# EAGLE design esp32_with_oled_128x64_v2 (EAGLE 9.5.2)
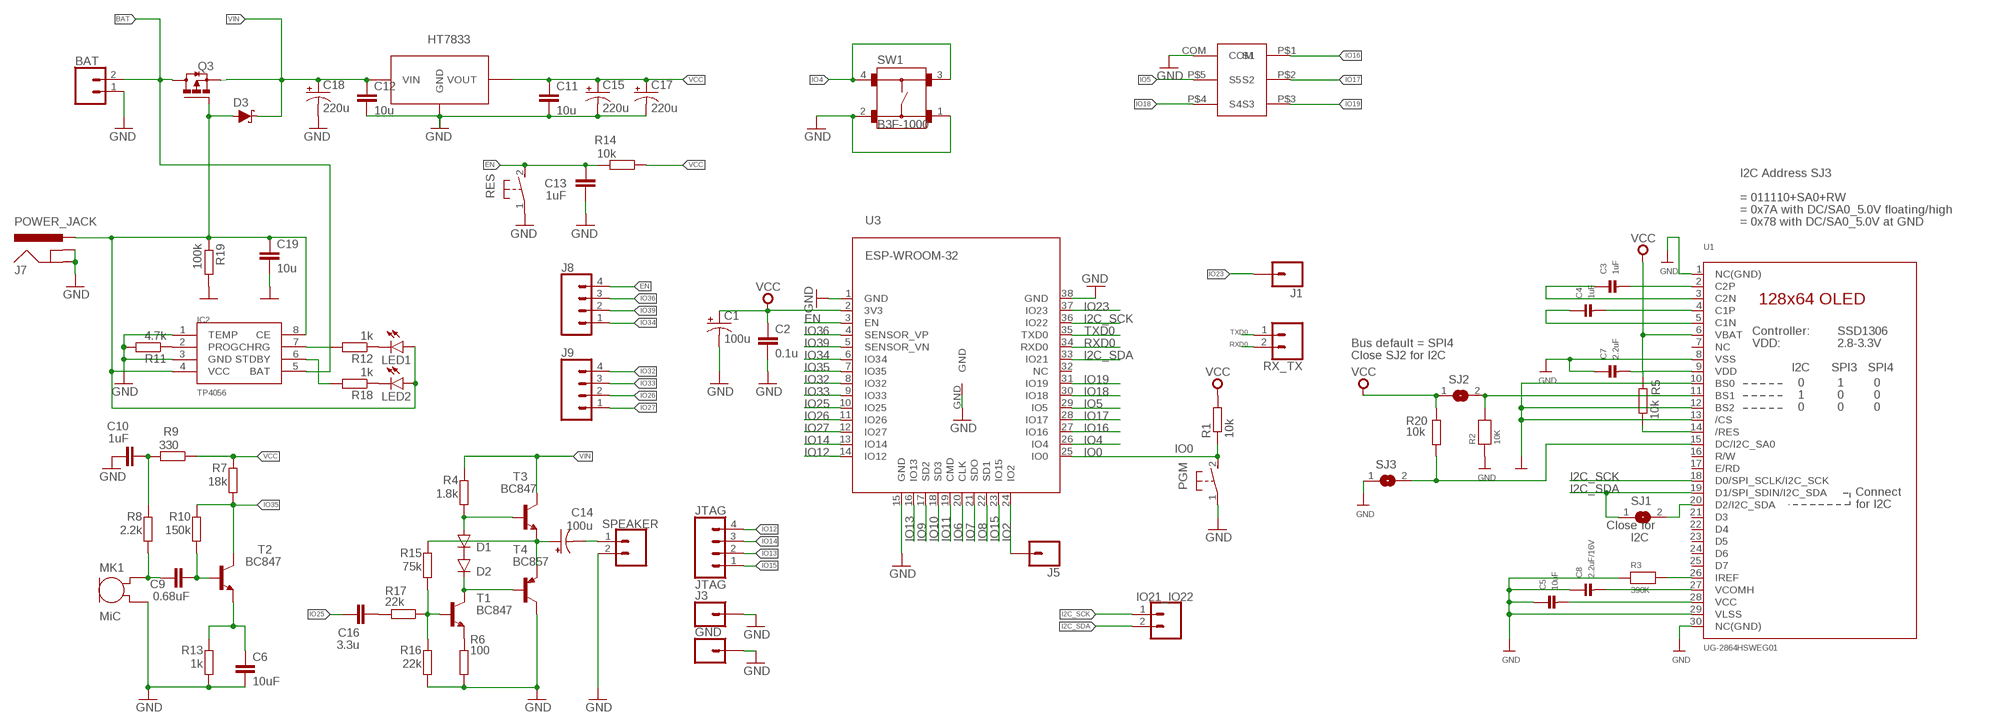
[diagram p0: schematic, sheet 1]

## Parts
BAT  CONN_02  [1X02]
C1  100u  CAP_POLSMD  [VISHAY_C]
C2  0.1u  CAP0805  [0805]
C3  1uF  CAP_CERAMIC0805  [0805]
C4  1uF  CAP_CERAMIC0805  [0805]
C5  10uF  CAP_CERAMIC0805  [0805]
C6  10uF  CAP0805  [0805]
C7  2.2uF  CAP_CERAMIC0805  [0805]
C8  2.2uF/16V  CAP_CERAMIC0805  [0805]
C9  0.68uF  CAP0805  [0805]
C10  1uF  CAP0805  [0805]
C11  10u  C-EUC0805K  [C0805K]
C12  10u  C-EUC0805K  [C0805K]
C13  1uF  CAP0805  [0805]
C14  100u  CAP_POLPTH1  [CPOL-RADIAL-100UF-25V]
C15  220u  CAP_POLPTH1  [CPOL-RADIAL-100UF-25V]
C16  3.3u  CAP0805  [0805]
C17  220u  CAP_POLPTH1  [CPOL-RADIAL-100UF-25V]
C18  220u  CAP_POLPTH1  [CPOL-RADIAL-100UF-25V]
C19  10u  C-EUC0805K  [C0805K]
D1  DIODE-SOD323-W  [SOD323-W]
D2  DIODE-SOD323-W  [SOD323-W]
D3  DIODE-SCHOTTKY-BAT20J  [SOD-323]
GND  CONN_01  [1X01]
IC2  TP4056  [SOP-8]
IO21_IO22  CONN_02  [1X02]
J1  CONN_01  [1X01]
J3  CONN_01  [1X01]
J5  CONN_01  [1X01]
J7  POWER_JACK  [POWER_JACK_PTH]
J8  CONN_04  [1X04]
J9  CONN_04  [1X04]
JTAG  JTAG  CONN_04  [1X04]
LED1  LED3MM  [LED3MM]
LED2  LEDCHIP-LED0805  [CHIP-LED0805]
MK1  MiC  CMA-4544PF-W  [CMA-4544PF-W]
PGM  DTSM-3  [DTSM-3]
Q3  FDN360P  [SUPER-SOT3]
R1  10k  R-EU_R0805  [R0805]
R2  10K  RESISTOR0805_NOTHERMALS  [0805_NOTHERMALS]
R3  390K  RESISTOR0805_NOTHERMALS  [0805_NOTHERMALS]
R4  1.8k  R-EU_R0805  [R0805]
R5  10k  R-EU_R0805  [R0805]
R6  100  R-EU_R0805  [R0805]
R7  18k  R-EU_R0805  [R0805]
R8  2.2k  R-EU_R0805  [R0805]
R9  330  R-EU_R0805  [R0805]
R10  150k  R-EU_R0805  [R0805]
R11  4.7k  R-EU_R0805  [R0805]
R12  1k  R-EU_R0805  [R0805]
R13  1k  R-EU_R0805  [R0805]
R14  10k  R-EU_R0805  [R0805]
R15  75k  R-EU_R0805  [R0805]
R16  22k  R-EU_R0805  [R0805]
R17  22k  R-EU_R0805  [R0805]
R18  1k  R-EU_R0805  [R0805]
R19  100k  R-EU_R0805  [R0805]
R20  10k  R-EU_R0805  [R0805]
RES  DTSM-3  [DTSM-3]
RX_TX  CONN_02  [1X02]
SJ1  SOLDERJUMPERREFLOW_NOPASTE  [SOLDERJUMPER_REFLOW_NOPASTE]
SJ2  SOLDERJUMPERREFLOW_NOPASTE  [SOLDERJUMPER_REFLOW_NOPASTE]
SJ3  SOLDERJUMPERREFLOW_NOPASTE  [SOLDERJUMPER_REFLOW_NOPASTE]
SPEAKER  CONN_02  [1X02]
SW1  B3F-1000  [B3F-1000]
T1  BC847  [SOT23]
T2  BC847  [SOT23]
T3  BC847  [SOT23]
T4  BC857  BC857ASMD  [SOT23-BEC]
U1  UG-2864HSWEG01  DISP_OLED_UG-2864HSWEG010.96"  [UG-2864HSWEG01_0.96IN_WRAPAROUND]
U3  ESP-WROOM-32  [ESP-WROOM-32]
U$1  DJOYSTICK-MY  [DJOYSTIC-MY]
U$3  HT7833  HT7333  [SOT89]

## Nets
BAT: BAT.2 IC2.5(BAT) Q3.3(D)
EN: C13.2 J8.4 R14.2 RES.2 U3.3(EN)
GND: BAT.1 C1.- C2.2 C5.1 C6.2 C7.1 C8.1 C10.1 C11.2 C12.2 C13.1 C15.2(-) C17.2(-) C18.2(-) C19.2 GND.1 IC2.1(TEMP) IC2.3(GND) J3.1 J7.GND J7.GNDBREAK MK1.2(GND) PGM.1 R2.1 R3.1 R6.1 R11.2 R13.1 R16.1 R19.2 RES.1 SJ3.1 SPEAKER.2 SW1.1 SW1.2 T4.C U1.1(NC(GND)) U1.8(VSS) U1.10(BS0) U1.12(BS2) U1.13(/CS) U1.29(VLSS) U1.30(NC(GND)) U3.1(GND) U3.15(GND) U3.38(GND) U3.GND U$1.COM U$3.GND
I2C_SCK: IO21_IO22.1 U1.18(D0/SPI_SCLK/I2C_SCK) U3.36(IO22)
I2C_SDA: IO21_IO22.2 SJ1.1 U1.19(D1/SPI_SDIN/I2C_SDA) U3.33(IO21)
IO0: PGM.2 R1.1 U3.25(IO0)
IO2: J5.1 U3.24(IO2)
IO4: SW1.3 SW1.4 U3.26(IO4)
IO5: U3.29(IO5) U$1.P$5(S5)
IO6: U3.20(CLK)
IO7: U3.21(SDO)
IO8: U3.22(SD1)
IO9: U3.17(SD2)
IO10: U3.18(SD3)
IO11: U3.19(CMD)
IO12: JTAG.4 U3.14(IO12)
IO13: JTAG.2 U3.16(IO13)
IO14: JTAG.3 U3.13(IO14)
IO15: JTAG.1 U3.23(IO15)
IO16: U3.27(IO16) U$1.P$1(S1)
IO17: U3.28(IO17) U$1.P$2(S2)
IO18: U3.30(IO18) U$1.P$4(S4)
IO19: U3.31(IO19) U$1.P$3(S3)
IO23: J1.1 U3.37(IO23)
IO25: C16.1 U3.10(IO25)
IO26: J9.2 U3.11(IO26)
IO27: J9.1 U3.12(IO27)
IO32: J9.4 U3.8(IO32)
IO33: J9.3 U3.9(IO33)
IO34: J8.1 U3.6(IO34)
IO35: R7.1 R10.2 T2.3(C) U3.7(IO35)
IO36: J8.3 U3.4(SENSOR_VP)
IO39: J8.2 U3.5(SENSOR_VN)
N$1: R2.2 SJ2.2 U1.11(BS1)
N$2: SJ1.2 U1.20(D2/I2C_SDA)
N$3: R3.2 U1.26(IREF)
N$4: C3.2 U1.2(C2P)
N$5: C3.1 U1.3(C2N)
N$6: C4.2 U1.4(C1P)
N$7: C4.1 U1.5(C1N)
N$8: C19.1 D3.A IC2.4(VCC) IC2.8(CE) J7.PWR LED1.A LED2.A Q3.1(G) R19.1
N$9: C14.2(-) SPEAKER.1
N$10: C16.2 R17.2
N$11: C5.2 U1.28(VCC)
N$12: C8.2 U1.27(VCOMH)
N$13: D1.A R4.1 T3.1(B)
N$14: C6.1 R13.2 T2.2(E)
N$15: C9.2 R10.1 T2.1(B)
N$16: C10.2 R8.2 R9.2
N$17: C9.1 MK1.1(OUT) R8.1
N$18: D2.C T1.3(C) T4.B
N$19: IC2.2(PROG) R11.1
N$20: R15.1 R16.2 R17.1 T1.1(B)
N$21: LED1.K(C) R12.1
N$22: IC2.7(CHRG) R12.2
N$24: D1.C D2.A
N$25: R6.2 T1.2(E)
N$26: C14.1(+) R15.2 T3.2(E) T4.E
N$27: LED2.C R18.1
N$28: IC2.6(STDBY) R18.2
N$29: R20.2 SJ3.2 U1.15(DC/I2C_SA0)
N$30: R5.1 U1.14(/RES)
RXD0: RX_TX.2 U3.34(RXD0)
TXD0: RX_TX.1 U3.35(TXD0)
VCC [vcc]: C1.+ C2.1 C7.2 C11.1 C15.1(+) C17.1(+) R1.2 R5.2 R7.2 R9.1 R14.1 R20.1 SJ2.1 U1.6(VBAT) U1.9(VDD) U3.2(3V3) U$3.VOUT
VIN: C12.1 C18.1(+) D3.C Q3.2(S) R4.2 T3.3(C) U$3.VIN
Unconnected: U1.7(NC) U1.16(R/W) U1.17(E/RD) U1.21(D3) U1.22(D4) U1.23(D5) U1.24(D6) U1.25(D7) U3.32(NC)

## Notes on the sheet
- I2C Address SJ3
- = 011110+SA0+RW
- = 0x7A with DC/SA0_5.0V floating/high
- = 0x78 with DC/SA0_5.0V at GND
- Bus default = SPI4
- Close SJ2 for I2C
- Close for
- I2C

## Library data of the parts
BAT IO21_IO22 RX_TX SPEAKER = SparkFun-Connectors:CONN_02: Multi connection point. Often used as Generic Header-pin footprint for 0.1 inch spaced/style header connections On any of the 0.1 inch spaced packages, you can populate with these: Break Away Headers - Straight <https://www.sparkfun.com/products/116> (PRT-00116) Break Away Male Headers - Right Angle <https://www.sparkfun.com/products/553> (PRT-00553) Female Headers <https://www.sparkfun.com/products/115> (PRT-00115) Break Away Headers - Machine Pin <https://www.sparkfun.com/products/117> (PRT-00117) Break Away Female Headers - Swiss Machine Pin <https://www.sparkfun.com/products/743> (PRT-00743) For SCREWTERMINALS and SPRING TERMINALS visit here: Screw Terimnals on SparkFun.com <https://www.sparkfun.com/search/results?term=Screw+Terminals> (5mm/3.5mm/2.54mm spacing) This device is also useful as a general connection point to wire up your design to another part of your project. Our various solder wires solder well into these plated through hole pads. Hook-Up Wire - Assortment (Stranded, 22 AWG) <https://www.sparkfun.com/products/11375> (PRT-11375) Hook-Up Wire - Assortment (Solid Core, 22 AWG) <https://www.sparkfun.com/products/11367> (PRT-11367) View the entire wire category on our website here <https://www.sparkfun.com/categories/141> Special notes: Molex polarized connector foot print use with: PRT-08233 with associated crimp pins and housings. 2.54_SCREWTERM for use with PRT-10571. 3.5mm Screw Terminal footprints for PRT-08084 5mm Screw Terminal footprints for use with PRT-08432
C1 C14 C15 C17 C18 = SparkFun-Passives:CAP_POL: Capacitor Polarized These are standard SMD and PTH capacitors. Normally 10uF, 47uF, and 100uF in electrolytic and tantalum varieties. Always verify the external diameter of the through hole cap, it varies with capacity, voltage, and manufacturer. The EIA devices should be standard.
C2 C6 C9 C10 C13 C16 = SparkFun-Passives:CAP: Capacitor Standard 0603 ceramic capacitor, and 0.1" leaded capacitor.
C3-C5 C7 C8 = microbuilder:CAP_CERAMIC: Ceramic Capacitors 0402 - 0402 Surface Mount Capacitors 16pF 50V 5% [Digikey: 445-4899-2-ND] 18pF 50V 5% [Digikey: 490-1281-2-ND] 22pF 50V 5% [Digikey: 490-1283-2-ND] 68pF 50V 5% [Digikey: 490-1289-2-ND] 0.1uF 10V 10% [Digikey: 490-1318-2-ND] 1.0uF 6.3V 10% [Digikey: 490-1320-2-ND] 0603 - 0603 Surface Mount Capacitors 16 pF 50V 5% [Digikey: 445-5051-2-ND] 22 pF 50V [Digikey: PCC220ACVTR-ND] 33 pF 50V 5% [Digikey: 490-1415-1-ND] 56pF 50V 5% [Digikey: 490-1421-1-ND] 220pF 50V 5% [Digikey: 445-1285-1-ND] 680 pF 50V 2200 pF 50V 5% C0G [Digikey: 445-1297-1-ND] 5600 pF 100V 5% X7R [Digikey: 478-3711-1-ND] 0.1 µF 25V 10% [Digikey: PCC2277TR-ND] 0.22 µF 16V 10% X7R [Digikey: 445-1318-1-ND] 1.0 µF 25V 10% [Digikey: 445-5146-2-ND] 0603 - RF Specific 3pF 250V +/-0.1pF RF [Digikey: 712-1347-1-ND] 18 pF 250V 5% [Digikey: 478-3505-1-ND or 712-1322-1-ND] 56 pF 250V 5% C0G RF [Digikey: 490-4867-1-ND] 68 pF 250V RF [Digikey: 490-4868-1-ND] 0805 - 0805 Surface Mount Capacitors 220 pF 250V 2% RF Ceramic Capacitor [Digikey: 712-1398-1-ND] 1000 pF 50V 2% NP0 Ceramic Capacitor [Digikey: 478-3760-1-ND] 0.1 µF 25V 10% Ceramic Capacitor [Digikey: PCC1828TR-ND] 1.0 µF 16V 10% Ceramic Capacitor[Digikey: 490-1691-2-ND] 10.0 µF 10V 10% Ceramic Capacitor[Digikey: 709-1228-1-ND] 10.0 uF 16V 10% Ceramic Capacitor [Digikey: 478-5165-2-ND] 47 uF 6.3V 20% Ceramic Capacitor [Digikey: 587-1779-1-ND or 399-5506-1-ND] 1206 - 1206 Surface Mount Capacitors 47uF 10V 20% Ceramic Capacitor [Digikey: 490-5528-1-ND or 399-5508-1-ND or 445-6010-1-ND] 100uF 6.3V -20%, +80% Y5V Ceramic Capacitor (Digikey: 490-4512-1-ND, Mouser: 81-GRM31CF50J107ZE1L)
C11 C12 C19 = rcl:C-EU: CAPACITOR, European symbol; SPICEPREFIX: C
D1 D2 = diode:DIODE-: DIODE
D3 = SparkFun-DiscreteSemi:DIODE-SCHOTTKY: Schottky diode A Schottky diode is a semiconductor diode which has a low forward voltage drop and a very fast switching action.; PROD_ID: DIO-11623; VALUE: 1A/23V/620mV
GND J1 J3 J5 = SparkFun-Connectors:CONN_01: Single connection point. Often used as Generic Header-pin footprint for 0.1 inch spaced/style header connections On any of the 0.1 inch spaced packages, you can populate with these: Break Away Headers - Straight <https://www.sparkfun.com/products/116> (PRT-00116) Break Away Male Headers - Right Angle <https://www.sparkfun.com/products/553> (PRT-00553) Female Headers <https://www.sparkfun.com/products/115> (PRT-00115) Break Away Headers - Machine Pin <https://www.sparkfun.com/products/117> (PRT-00117) Break Away Female Headers - Swiss Machine Pin <https://www.sparkfun.com/products/743> (PRT-00743) This device is also useful as a general connection point to wire up your design to another part of your project. Our various solder wires solder well into these plated through hole pads. Hook-Up Wire - Assortment (Stranded, 22 AWG) <https://www.sparkfun.com/products/11375> (PRT-11375) Hook-Up Wire - Assortment (Solid Core, 22 AWG) <https://www.sparkfun.com/products/11367> (PRT-11367) View the entire wire category on our website here <https://www.sparkfun.com/categories/141> Special notes: SMTSO-256-ET is a "flush mount" nut for a 4-40 screw. We mostly use this on specialty testbeds; it is a nice way to connect hardware to your PCB at an adjustable hieght. Also note, the SNAP packages are for using a snappable style connector. We sell a baggie of snaps and they are also used on two LilyPad designs: Snap Assortment - 30 pack (male and female) <https://www.sparkfun.com/products/11347> (DEV-11347) LilyPad Arduino SimpleSnap <https://www.sparkfun.com/products/10941> (DEV-10941) LilyPad SimpleSnap Protoboard <https://www.sparkfun.com/products/10940> (DEV-10940)
IC2 = TP4056:TP4056
J7 = SparkFun-Connectors:POWER_JACK: Power Jack Connector This is the standard 5.5mm barrel jack for power. The PTH is the most common, proven, reliable, footprint. The Slot footprint only works if the mill layer is transmitted to the PCB fab house so be warned. Here are the connectors we sell at SparkFun: DC Barrel Power Jack/Connector <https://www.sparkfun.com/products/119> (PRT-00119) DC Barrel Power Jack/Connector (SMD) <https://www.sparkfun.com/products/12748> (PRT-12748) DC Barrel Jack Adapter - Breadboard Compatible <https://www.sparkfun.com/products/10811> (PRT-10811) It is used on this SparkFun product (and many, many others): SparkFun RedBoard - Programmed with Arduino <https://www.sparkfun.com/products/12757> (DEV-12757) Also, if you need a mating power supply or connector, please check these out: Wall Adapter Power Supply - 9VDC 650mA <https://www.sparkfun.com/products/298> (TOL-00298) DC Barrel Jack Adapter - Male <https://www.sparkfun.com/products/10287> (PRT-10287); PROD_ID: CONN-08197
J8 J9 JTAG = SparkFun-Connectors:CONN_04: Multi connection point. Often used as Generic Header-pin footprint for 0.1 inch spaced/style header connections On any of the 0.1 inch spaced packages, you can populate with these: Break Away Headers - Straight <https://www.sparkfun.com/products/116> (PRT-00116) Break Away Male Headers - Right Angle <https://www.sparkfun.com/products/553> (PRT-00553) Female Headers <https://www.sparkfun.com/products/115> (PRT-00115) Break Away Headers - Machine Pin <https://www.sparkfun.com/products/117> (PRT-00117) Break Away Female Headers - Swiss Machine Pin <https://www.sparkfun.com/products/743> (PRT-00743) For SCREWTERMINALS and SPRING TERMINALS visit here: Screw Terimnals on SparkFun.com <https://www.sparkfun.com/search/results?term=Screw+Terminals> (5mm/3.5mm/2.54mm spacing) This device is also useful as a general connection point to wire up your design to another part of your project. Our various solder wires solder well into these plated through hole pads. Hook-Up Wire - Assortment (Stranded, 22 AWG) <https://www.sparkfun.com/products/11375> (PRT-11375) Hook-Up Wire - Assortment (Solid Core, 22 AWG) <https://www.sparkfun.com/products/11367> (PRT-11367) View the entire wire category on our website here <https://www.sparkfun.com/categories/141> Special notes: Molex polarized connector foot print use with SKU : PRT-08231 with associated crimp pins and housings. 1MM SMD Version SKU: PRT-10208; PROD_ID: CONN-09696
LED1 LED2 = led:LED: LED OSRAM: - CHIPLED LG R971, LG N971, LY N971, LG Q971, LY Q971, LO R971, LY R971 LH N974, LH R974 LS Q976, LO Q976, LY Q976 LO Q996 - Hyper CHIPLED LW Q18S LB Q993, LB Q99A, LB R99A - SideLED LS A670, LO A670, LY A670, LG A670, LP A670 LB A673, LV A673, LT A673, LW A673 LH A674 LY A675 LS A676, LA A676, LO A676, LY A676, LW A676 LS A679, LY A679, LG A679 - Hyper Micro SIDELED® LS Y876, LA Y876, LO Y876, LY Y876 LT Y87S - SmartLED LW L88C, LW L88S LB L89C, LB L89S, LG L890 LS L89K, LO L89K, LY L89K LS L896, LA L896, LO L896, LY L896 - TOPLED LS T670, LO T670, LY T670, LG T670, LP T670 LSG T670, LSP T670, LSY T670, LOP T670, LYG T670 LG T671, LOG T671, LSG T671 LB T673, LV T673, LT T673, LW T673 LH T674 LS T676, LA T676, LO T676, LY T676, LB T676, LH T676, LSB T676, LW T676 LB T67C, LV T67C, LT T67C, LS T67K, LO T67K, LY T67K, LW E67C LS E67B, LA E67B, LO E67B, LY E67B, LB E67C, LV E67C, LT E67C LW T67C LS T679, LY T679, LG T679 LS T770, LO T770, LY T770, LG T770, LP T770 LB T773, LV T773, LT T773, LW T773 LH T774 LS E675, LA E675, LY E675, LS T675 LS T776, LA T776, LO T776, LY T776, LB T776 LHGB T686 LT T68C, LB T68C - Hyper Mini TOPLED® LB M676 - Mini TOPLED Santana® LG M470 LS M47K, LO M47K, LY M47K Source: http://www.osram.convergy.de LUXEON: - LUMILED® LXK2-PW12-R00, LXK2-PW12-S00, LXK2-PW14-U00, LXK2-PW14-V00 LXK2-PM12-R00, LXK2-PM12-S00, LXK2-PM14-U00 LXK2-PE12-Q00, LXK2-PE12-R00, LXK2-PE12-S00, LXK2-PE14-T00, LXK2-PE14-U00 LXK2-PB12-K00, LXK2-PB12-L00, LXK2-PB12-M00, LXK2-PB14-N00, LXK2-PB14-P00, LXK2-PB14-Q00 LXK2-PR12-L00, LXK2-PR12-M00, LXK2-PR14-Q00, LXK2-PR14-R00 LXK2-PD12-Q00, LXK2-PD12-R00, LXK2-PD12-S00 LXK2-PH12-R00, LXK2-PH12-S00 LXK2-PL12-P00, LXK2-PL12-Q00, LXK2-PL12-R00 Source: www.luxeon.com KINGBRIGHT: KA-3528ASYC Source: www.kingbright.com
MK1 = Microphone:CMA-4544PF-W: MIC COND ANALOG OMNI -44DB Manufacturer's datasheet <https://www.cui.com/product/resource/cma-4544pf-w.pdf>; CREATED_BY: PCBLayout.com; DIGIKEY_PART_NUMBER: 102-1721-ND; MANUFACTURER: CUI Inc.; MPN: CMA-4544PF-W
PGM RES = switch-tact:DTSM-3
Q3 = transistor-power:FDN360P: Single P-Channel, PowerTrench (R) MOSFET Source: http://www.fairchildsemi.com/ds/FD/FDN360P.pdf
R1 R4-R20 = rcl:R-EU_: RESISTOR, European symbol
R2 R3 = microbuilder:RESISTOR: Resistors 0402 - 0402 Surface Mount Package 22 Ohm 1% 1/16W [Digikey: 311-22.0LRTR-ND] 33 Ohm 5% 1/16W 1.0K 5% 1/16W 1.5K 5% 1/16W 2.0K 1% 1/16W 10.0K 1% 1/16W [Digikey: 311-10.0KLRTR-ND] 10.0K 5% 1/16W [Digikey: RMCF0402JT10K0TR-ND] 12.1K 1% 1/16W [Digikey: 311-22.0LRTR-ND] 100.0K 5% 1/16W 0603 - 0603 Surface Mount Package 0 Ohm 1/10 Watt 1% Resistor 15 Ohm 1/10 Watt 1% Resistor 33 Ohm 1/10 Watt 1% Resistor 49.9 Ohm 1/10 Watt 1% Resistor 100 Ohm 1/10 Watt 1% Resistor 150 Ohm 1/10 Watt 1% Resistor 240 Ohm 1/10 Watt 1% Resistor 390 Ohm 1/10 Watt 1% Resistor 560 Ohm 1/10 Watt 1% Resistor 680 Ohm 1/10 Watt 1% Resistor 750 Ohm 1/10 Watt 1% Resistor 1.0K Ohm 1/10 Watt 1% Resistor 1.5K Ohm 1/10 Watt 1% Resistor 2.0K Ohm 1/10 Watt 1% Resistor 2.2K Ohm 1/10 Watt 1% Resistor 3.3K Ohm 1/10 Watt 1% Resistor 4.7K Ohm 1/10 Watt 1% Resistor 10.0K Ohm 1/10 Watt 1% Resistor 12.0K Ohm 1/10 Watt 1% Resistor 12.1K Ohm 1/10 Watt 1% Resistor 20.0K Ohm 1/10 Watt 1% Resistor 33.0K Ohm 1/10 Watt 1% Resistor 100.0K Ohm 1/10 Watt 1% Resistor 0805 - 0805 Surface Mount Package 0 Ohm 1/8 Watt 1% Resistor 33 Ohm 1/8 Watt 1% Resistor 100 Ohm 1/8 Watt 1% Resistor 150 Ohm 1/8 Watt 1% Resistor 200 Ohm 1/8 Watt 1% Resistor 240 Ohm 1/8 Watt 1% Resistor 330 Ohm 1/8 Watt 1% Resistor 390 Ohm 1/8 Watt 1% Resistor 470 Ohm 1/8 Watt 1% Resistor 1.0K Ohm 1/8 Watt 1% Resistor 1.5K Ohm 1/8 Watt 1% Resistor 2.0K Ohm 1/8 Watt 1% Resistor 4.7K Ohm 1/8 Watt 1% Resistor 5.1K Ohm 1/8 Watt 1% Resistor 5.6K Ohm 1/8 Watt 1% Resistor 10.0K Ohm 1/8 Watt 1% Resistor 22.0K Ohm 1/8 Watt 1% Resistor 33.0K Ohm 1/8 Watt 1% Resistor 100K Ohm 1/8 Watt 1% Resistor 1206 - 1206 Surface Mount Package 2012 - 2010 Surface Mount Package 0.11 Ohm 1/2 Watt 1% Resistor - Digikey: RHM.11UCT-ND
SJ1-SJ3 = microbuilder:SOLDERJUMPER: SMD Solder JUMPER Solder the two pads together to create a connection, or remove the solder to break it. REFLOW - Use this footprint for solder paste and reflow ovens. WAVE - Use this footprint for hand-soldering (larger pads). CLOSED - Has a trace between the two pads to ensure it is closed by default. The trace needs to be cut to disable the jumper, and can be closed again by creating a solder bridge between the two pads.
SW1 = Switch:B3F-1000: Tactile Switch SPST-NO Top Actuated Through Hole Manufacturer's datasheet <https://omronfs.omron.com/en_US/ecb/products/pdf/en-b3f.pdf>; CREATED_BY: PCBLayout.com; DIGI_KEY_PART_NUMBER: SW400-ND; MANUFACTURER: Omron Electronics Inc-EMC Div; MPN: B3F-1000; PACKAGE: SPST-NO
T1-T3 = transistor:BC847: NPN TRANSISTOR
T4 = transistor-pnp:BC857*: PNP Transistror
U1 = microbuilder:DISP_OLED_UG-2864HSWEG01: UG-2864HSWEG01 OLED display Both 1.3" and 0.96" models share the same FPC tab footprint, only the screen dimensions vary.
U3 = esp32:ESP-WROOM-32
U$1 = esp32_:DJOYSTICK-MY
U$3 = HT7333_SOT89:HT7333

## Module OLED_128_60
Ports: 

### Library data of the parts

## Net classes
0 default: width 0.254 mm, drill 0.305 mm, clearance 0.152 mm
1 gnd: width 0.635 mm, drill 0.635 mm, clearance 0.254 mm
2 vcc: width 0.254 mm, drill 0.406 mm, clearance 0.254 mm

## Board
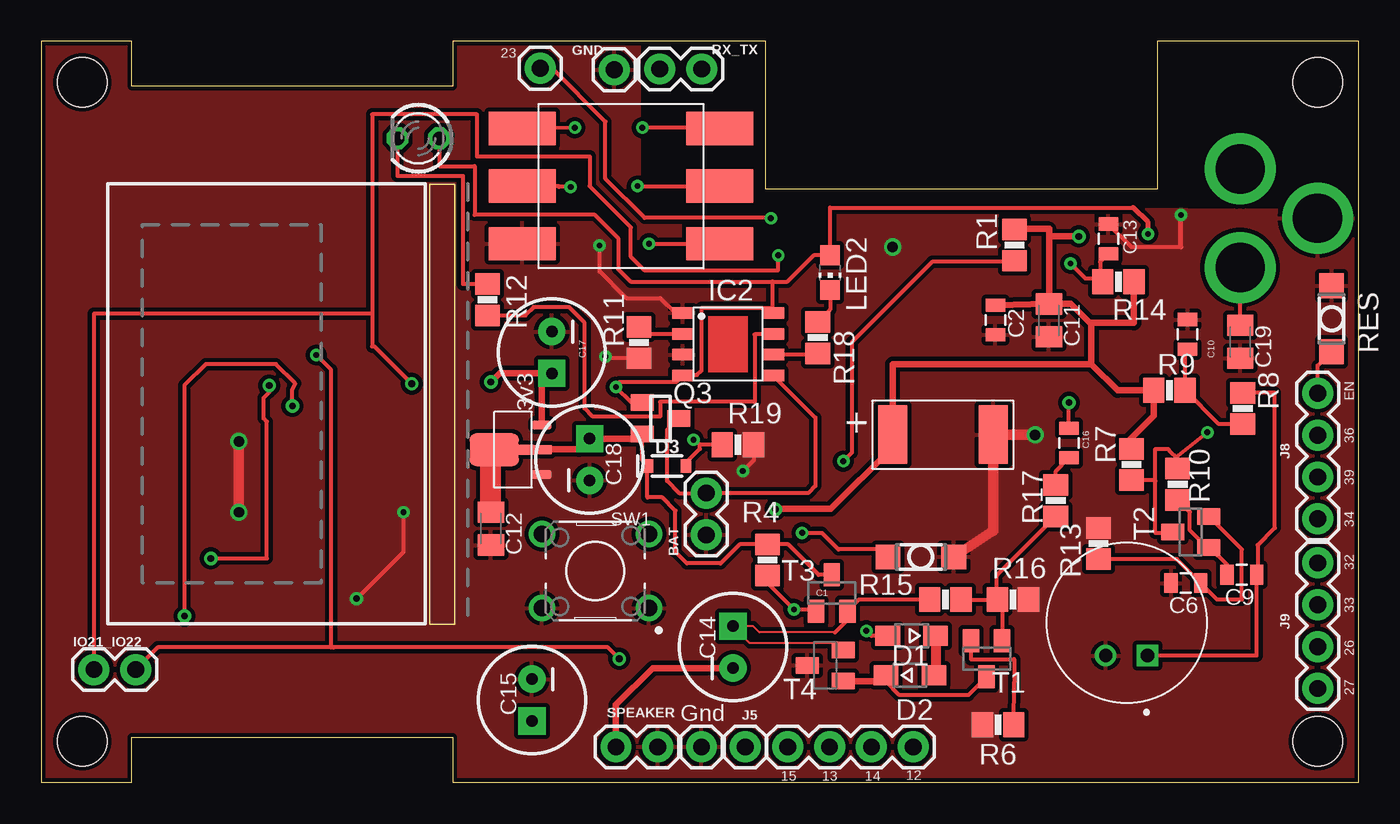
[diagram p1: board, top side]
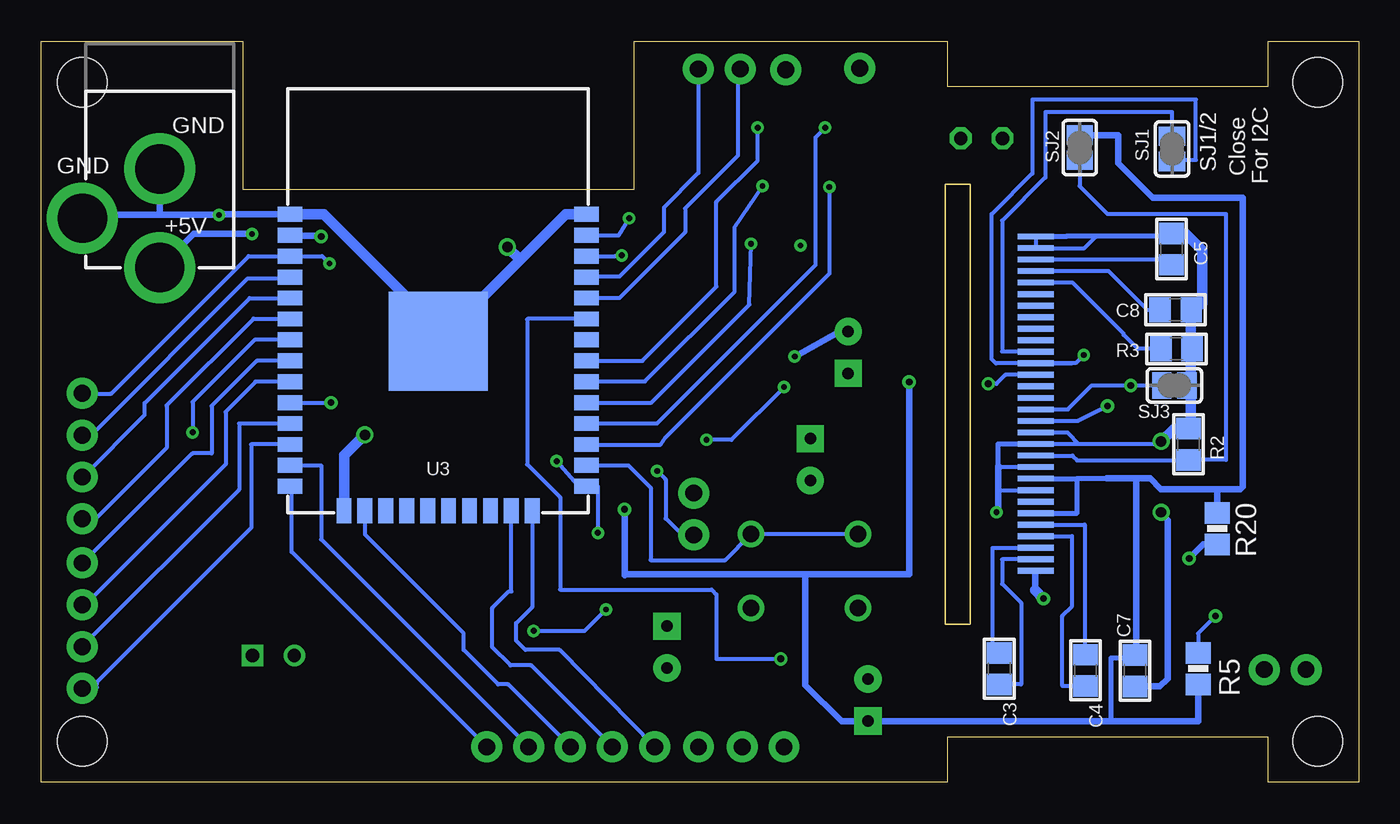
[diagram p2: board, bottom side, seen from below]

Size 80 x 45 mm. Coordinates in mm from the lower left corner, seen from the top.
Outline: 0,0 5.5,0 5.5,2.75 25,2.75 25,0 80,0 80,45 67.75,45 67.75,36 44,36 44,45 25,45 25,42.25 5.5,42.25 5.5,45 0,45 0,0
Copper layers (1*16): Top 0.035mm / dielectric 1.5mm / Bottom 0.035mm
Design rules "default *": minimum track width 6mil, minimum drill 0.35mm, track to track 6mil, track to pad 6mil, pad to pad 6mil, via to via 6mil, smd to smd 6mil, copper to edge 10mil, drill to drill 6mil, minimum pad ring 10mil, minimum via ring 8mil, stop-mask expansion 4mil, vias tented up to drill 0mil, thermal gap 10mil
Holes 3 mm at 2.5,42.5 2.5,2.5 77.5,2.5 77.5,42.5
Milling: 4 lines

### Footprints (pad centres in the part's own frame; a part is rotated, then mirrored left to right if it is on the bottom)
1X02 = drill 1.016 pad 1.88: 1 0,0; 2 2.54,0
VISHAY_C = smd 3.556 x 1.778: + 0,3.048; - 0,-3.048
0805 = smd 0.8 x 1.2: 1 -0.9,0; 2 0.9,0
0805' = smd 1.3 x 1.5: 1 -0.95,0; 2 0.95,0
C0805K = smd 1.3 x 1.6: 1 -1,0; 2 1,0
CPOL-RADIAL-100UF-25V = drill 0.7 pad 1.651 square: 1 1.27,0 | drill 0.7 pad 1.651: 2 -1.27,0
SOD323-W = smd 1.5 x 1.2: A 1.45,0; C -1.45,0
SOD-323 = smd 0.63 x 0.83: A 1.15,0; C -1.15,0
1X01 = drill 1.016 pad 1.88: 1 0,0
SOP-8 = smd 1.3 x 0.7: 1 -2.75,1.905; 2 -2.75,0.635; 3 -2.75,-0.635; 4 -2.75,-1.905; 5 2.75,-1.905; 6 2.75,-0.635; 7 2.75,0.635; 8 2.75,1.905
POWER_JACK_PTH = drill 2.997 pad 4.318: GND 0,7.7; GNDBREAK 4.7,10.7; PWR 0,13.7
1X04 = drill 1.016 pad 1.88: 1 0,0; 2 2.54,0; 3 5.08,0; 4 7.62,0
LED3MM = drill 0.813 octagon: A -1.27,0; K 1.27,0
CHIP-LED0805 = smd 1.2 x 1.2: A 0,-1.05; C 0,1.05
CMA-4544PF-W = drill 0.8 square: 1 2,1.27 | drill 0.8: 2 2,-1.27
DTSM-3 = smd 1.5 x 1.5: 1 -2,0; 2 2,0
SUPER-SOT3 = smd 1 x 1.4: 1 -0.95,-1.1; 2 0.95,-1.1; 3 0,1.1
R0805 = smd 1.3 x 1.5: 1 -0.95,0; 2 0.95,0
0805_NOTHERMALS = smd 1.3 x 1.5: 1 -0.95,0; 2 0.95,0
SOLDERJUMPER_REFLOW_NOPASTE = smd 1.168 x 1.6: 1 -0.762,0; 2 0.762,0
B3F-1000 = drill 1 pad 1.6: 1 -3.25,2.25; 2 3.25,2.25; 3 -3.25,-2.25; 4 3.25,-2.25
SOT23 = smd 1 x 1.4: 1 -0.95,-1.1; 2 0.95,-1.1; 3 0,1.1
SOT23-BEC = smd 1 x 1.4: B -0.95,-1.1; C 0,1.1; E 0.95,-1.1
UG-2864HSWEG01_0.96IN_WRAPAROUND = smd 0.35 x 2.2 bottom: 1 -10.15,-1.2; 2 -9.45,-1.2; 3 -8.75,-1.2; 4 -8.05,-1.2; 5 -7.35,-1.2; 6 -6.65,-1.2; 7 -5.95,-1.2; 8 -5.25,-1.2; 9 -4.55,-1.2; 10 -3.85,-1.2; 11 -3.15,-1.2; 12 -2.45,-1.2; 13 -1.75,-1.2; 14 -1.05,-1.2; 15 -0.35,-1.2; 16 0.35,-1.2; 17 1.05,-1.2; 18 1.75,-1.2; 19 2.45,-1.2; 20 3.15,-1.2; 21 3.85,-1.2; 22 4.55,-1.2; 23 5.25,-1.2; 24 5.95,-1.2; 25 6.65,-1.2; 26 7.35,-1.2; 27 8.05,-1.2; 28 8.75,-1.2; 29 9.45,-1.2; 30 10.15,-1.2
ESP-WROOM-32 = smd 0.9 x 1.5: 1 7.7,9; 2 6.43,9; 3 5.16,9; 4 3.89,9; 5 2.62,9; 6 1.35,9; 7 0.08,9; 8 -1.19,9; 9 -2.46,9; 10 -3.73,9; 11 -5,9; 12 -6.27,9; 13 -7.54,9; 14 -8.81,9; 25 -8.81,-9; 26 -7.54,-9; 27 -6.27,-9; 28 -5,-9; 29 -3.73,-9; 30 -2.46,-9; 31 -1.19,-9; 32 0.08,-9; 33 1.35,-9; 34 2.62,-9; 35 3.89,-9; 36 5.16,-9; 37 6.43,-9; 38 7.7,-9 | smd 1.5 x 0.9: 15 -10.3,5.715; 16 -10.3,4.445; 17 -10.3,3.175; 18 -10.3,1.905; 19 -10.3,0.635; 20 -10.3,-0.635; 21 -10.3,-1.905; 22 -10.3,-3.175; 23 -10.3,-4.445; 24 -10.3,-5.715 | smd 6 x 6: GND 0,0
DJOYSTIC-MY = smd 4.064 x 2.032: COM -6,-3.5; P$1 -6,0; P$2 -6,3.5; P$3 6,3.5; P$4 6,0; P$5 6,-3.5
SOT89 = smd 0.559 x 1.194: GND -1.499,-0.597; VIN 0,-0.597; VOUT 1.499,-0.597 | smd 0.6 x 2: P$1 0,0.9 | smd 2 x 3: P$4 0,2.286

### Placement (x,y rotation side)
BAT  40.38,15.02 90 top
C1  54.75,21.11 90 top
C2  57.94,28.07 270 top
C3  1uF  [0805']  21.83,6.9 270 bottom
C4  1uF  [0805']  16.6,6.8 270 bottom
C5  10uF  [0805']  11.38,32.38 270 bottom
C6  69.5,12.1 180 top
C7  2.2uF  [0805']  13.59,6.78 90 bottom
C8  2.2uF/16V  [0805']  11.12,28.69 180 bottom
C9  72.9,12.6 180 top
C10  69.6,27.2 270 top
C11  61.18,28.05 270 top
C12  27.3,15.4 270 top
C13  64.8,33 270 top
C14  42,8.21 90 top
C15  29.8,5 270 top
C16  62.4,20.6 270 top
C17  31,26.1 270 top
C18  33.3,19.6 90 top
C19  72.8,26.75 270 top
D1  52.85,8.9 180 top
D2  52.75,6.5 0 top
D3  38,19.2 0 top
GND  34.79,43.27 0 top
IC2  41.7,26.6 0 top
IO21_IO22  3.2,6.85 0 top
J1  30.3,43.35 0 top
J3  40.09,2.15 0 top
J5  42.75,2.15 0 top
J7  72.8,44.95 180 bottom
J8  77.5,16 90 top
J9  77.5,5.7 90 top
JTAG  45.33,2.15 0 top
LED1  22.9,39.1 180 top
LED2  47.9,30.95 180 top
MK1  65.9,9.7 270 top
PGM  53.41,13.69 180 top
Q3  37.6,22.1 270 top
R1  59.09,32.62 90 top
R2  10.34,20.53 270 bottom
R3  11.07,26.32 180 bottom
R4  44.1,13.5 90 top
R5  9.75,6.9 270 bottom
R6  58.1,3.5 0 top
R7  66.2,19.3 90 top
R8  72.95,22.7 270 top
R9  68.5,23.8 0 top
R10  69,18.1 90 top
R11  36.3,26.7 270 top
R12  27.1,29.3 270 top
R13  64.2,14.5 270 top
R14  65.4,30.4 180 top
R15  54.9,11.1 180 top
R16  59,11.1 180 top
R17  61.6,17.1 90 top
R18  47.15,27 270 top
R19  42.3,20.5 0 top
R20  8.6,15.4 270 bottom
RES  78.35,28.15 270 top
RX_TX  40.1,43.31 180 top
SJ1  11.34,38.46 90 bottom
SJ2  16.94,38.54 270 bottom
SJ3  11.2,24.1 180 bottom
SPEAKER  34.9,2.15 0 top
SW1  33.65,12.83 180 top
T1  57.4,7.5 180 top
T2  69.8,15.2 90 top
T3  48,11.5 0 top
T4  47.6,7.1 90 top
U1  18.41,22.99 90 top
U3  55.9,26.78 90 bottom
U$1  35.2,36.2 0 top
U$3  29.8,20.2 90 top

### Tracks (layer width: path | path; a pad name or v marks a point on that pad's centre or on a via)
BAT
  Top 0.254: 44.6,24.55 IC2.5 47,22.14 47,18 46.56,17.56 BAT.2 38.74,17.56 38,18.3 38,21.4 Q3.3
EN  (via drill 0.35)
  Top 0.254: v62.5,31.5 63.4,30.6 64.3,30.6 | R14.2 64.3,30.4 64.3,30.6 | C13.2 64.3,31.6 64.3,30.6 | J8.4 77.5,25.3 RES.2
  Bottom 0.254: J8.4 77.48,23.6 75.75,23.6 67.4,31.95 U3.3 62.94,31.94 v62.5,31.5
GND  (via drill 0.35, 0.4, 0.64)
  Top 0.254: v33.9,32.6 33.9,31.02 35.52,29.4 37.6,29.4 38.49,28.5 IC2.1 | 61.05,27 C11.2 | C13.1 66.2,32.5 69.2,32.5 | v19.15,11.15 22,14 v22,16.4 | R11.2 34.51,25.75 34.51,25.79 34.45,25.85 v34.25,25.85 | R19.2 43.25,19.55 v42.6,18.9
  Top 0.305: R13.1 63.75,15.45 | 69.2,32.5 v69.2,34.45 | R11.2 36.1,25.75 36,25.85
  Top 0.635: 36.6,25.95 36.4,25.75 R11.2 | v12,20.7 v12,16.4 | PGM.1 57.8,15.28 C1.- 59.4,21.11 v60.35,21.1
  Bottom 0.254: U1.10 21.8,19.14 | 21.9,17.74 U1.8 | 17,20.54 U1.12 | 10.3,21.7 10.2,21.6 | U1.30 U1.29 16.66,32.44 15.95,33.15 | v33.9,32.6 33.96,32.66 | 19.65,12.1 19.61,12.14 U1.1 | v12,20.7 12.16,20.54 17,20.54 | v42.6,18.9 42.09,18.39 42.09,16.03 41.08,15.02 BAT.1 | SJ3.1 10.2,24.34 10.2,25.5 | U1.13 17.7,21.24 17,20.54
  Bottom 0.305: 11.65,33.15 15.95,33.15 17.75,33.15 17.76,33.14 U1.30 | U1.12 21.9,20.54 21.9,19.2 | J7.GNDBREAK 77.3,34.45 | 69.17,34.48 v69.2,34.45
  Bottom 0.406: 19.65,11.65 19.65,12.1 19.65,12.75 | v12,16.4 12,16.3 11.6,15.9 11.6,6.3 12.07,5.83 C7.1 | v22,16.4 21.9,16.5 21.9,17.74 21.9,19.2 21.84,19.14 21.8,19.14 | 77.3,34.45 72.8,34.45 | J7.GND 72.8,34.45 | 72.8,34.45 v69.2,34.45 | v34.25,25.85 31.54,27.37 C17.2 | U3.1 69.17,34.48
  Bottom 0.635: 11.65,33.15 C5.1 11.35,33.3 10.5,33.3 9.5,32.3 9.5,29.1 C8.1 10.2,28.6 10.2,26.35 R3.1 10.2,26.05 10.2,25.5 10.2,21.6 R2.1 10.65,21.45 11.25,21.45 v12,20.7 | 13.5,5.85 C7.1 | v19.15,11.15 19.65,11.65 | U3.38 46.92,34.5 48.15,34.5 50.92,31.73 | 50.92,31.73 55.8,26.85 U3.GND 55.65,27.3 62.85,34.5 64.65,34.5 64.66,34.48 U3.1 64.91,34.45 64.92,34.46 | v51.7,32.5 50.92,31.73 | v60.35,21.1 61.6,19.85 U3.15
  pour Top (isolate 0.254): 80.7,-0.7 -0.3,-0.7 -0.3,45.2 36.35,45.2 36.35,34.89 80.7,34.76
I2C_SCK  (via drill 0.35, 0.41)
  Top 0.254: 20.1,28.45 20.1,40.55 26.45,40.55 26.45,38 33.3,38 33.3,36.2 35.8,33.7 35.8,31.9 36.6,31.1 44.75,31.1 v44.75,32 | 20.1,28.45 20.1,26.45 20.25,26.45 v22.5,24.2 | 20.1,28.45 3.2,28.45 IO21_IO22.1
  Bottom 0.254: 46.95,31.8 U3.36 45.16,31.94 v44.75,32 | U1.18 21.46,24.74 22,24.2 v22.5,24.2
I2C_SDA  (via drill 0.35, 0.41)
  Top 0.254: v35.1,7.5 34.4,8.2 17.75,8.2 17.6,8.2 | 17.6,8.2 17.6,25.05 v16.7,25.95 | 17.6,8.2 7.09,8.2 IO21_IO22.2
  Bottom 0.254: U1.19 | SJ1.1 11.25,37.8 9.9,37.8 9.9,41.45 19.82,41.45 19.82,36.98 22.3,34.5 22.3,25.7 22.04,25.44 U1.19 | 46.45,28.25 46.5,28.2 46.8,28.2 U3.33 | U3.33 46.93,28.1 | v35.1,7.5 39,7.5 39,11.4 39.3,11.7 48.5,11.7 48.5,17.3 50.5,19.3 50.5,28.1 50.47,28.13 U3.33 | v16.7,25.95 17.2,25.45 17.45,25.45 | 17.45,25.45 19.05,25.45 | U1.19 17.46,25.44 17.45,25.45
IO0  (via drill 0.35)
  Top 0.254: PGM.2 50.95,14.15 48.4,14.15 47.4,15.15 v46.2,15.15 | v48.7,19.5 49.23,20.02 49.23,26.73 54.1,31.6 59.02,31.6 R1.1
  Bottom 0.254: v46.2,15.15 46.2,17.97 U3.25 46.95,18 47.4,18 v48.7,19.5
IO2
  Bottom 0.254: 50.25,16.5 U3.24 50.19,10.64 51.16,9.67 51.16,8.6 50.6,8.04 48.52,8.04 J5.1
IO4
  Bottom 0.254: SW1.4 SW1.3 38.48,13.5 43,13.5 43,17.9 44.34,19.24 U3.26
IO5  (via drill 0.35)
  Top 0.254: v36.9,32.7 U$1.P$5
  Bottom 0.254: U3.29 42.95,23.05 37,29 v36.9,32.7
IO12
  Bottom 0.254: JTAG.4 64.8,14 64.8,17.85 U3.14
IO13
  Bottom 0.254: U3.16 60.35,15.05 54.35,9.05 54.35,8.05 52.25,5.95 51.65,5.95 47.95,2.25 JTAG.2
IO14
  Bottom 0.254: JTAG.3 50.5,2.25 63,14.75 63,19.25 U3.13
IO15
  Bottom 0.254: U3.23 51.45,16.35 51.45,11.6 51.6,11.6 52.6,10.6 52.6,8.2 51.5,7.1 50.25,7.1 45.4,2.25 JTAG.1
IO16  (via drill 0.35)
  Top 0.254: v32.15,36.15 31.45,36.15 31.4,36.2 U$1.P$1
  Bottom 0.254: 46.8,20.55 U3.27 46.89,20.5 42.4,20.5 42.08,20.95 32.15,30.88 v32.15,36.15
IO17  (via drill 0.35)
  Top 0.254: v32.4,39.75 29.16,39.7 U$1.P$2
  Bottom 0.254: U3.28 46.89,21.8 42.6,21.8 33,31.4 33,39.15 v32.4,39.75
IO18  (via drill 0.35)
  Top 0.254: v36.2,36.2 U$1.P$4
  Bottom 0.254: 46.95,24.3 U3.30 46.87,24.35 43.35,24.35 37.9,29.8 37.9,33.7 v36.2,36.2
IO19  (via drill 0.35)
  Top 0.254: U$1.P$3 40.65,39.75 v36.5,39.75
  Bottom 0.254: 46.8,25.65 U3.31 43.51,25.59 39,30.1 39,35.25 36.5,37.75 v36.5,39.75
IO23  (via drill 0.35)
  Top 0.254: v44.3,34.25 44.3,34.28 36.64,34.28 34.26,36.66 34.26,40.12 31.03,43.35 J1.1
  Bottom 0.254: U3.37 44.94,33.21 v44.3,34.25
IO25  (via drill 0.4)
  Top 0.254: C16.1 v62.4,23.05
  Bottom 0.254: U3.10 v62.4,23.05
IO26
  Bottom 0.254: J9.2 77.56,8.19 67.97,17.77 67.97,21.78 U3.11
IO27
  Bottom 0.254: J9.1 77.45,5.75 76.62,5.75 76.6,6.1 67.25,15.45 67.25,20.51 U3.12
IO32
  Bottom 0.254: U3.8 66.91,25.59 69.65,22.85 69.65,19.98 70.83,19.98 77.5,13.3 J9.4
IO33
  Bottom 0.254: J9.3 77.47,10.75 77.35,10.75 68.8,19.3 68.8,22.5 66.98,24.32 U3.9
IO34
  Bottom 0.254: U3.6 64.92,28.15 67.1,28.15 72.4,22.85 72.35,22.8 72.35,20.35 76.7,16 J8.1
IO35  (via drill 0.35)
  Top 0.254: T2.3 68.7,15.15 67.65,15.15 67.65,18.3 | 67.65,18.3 67.6,18.35 R7.1 | 67.65,18.3 67.65,20.25 68.4,20.25 68.47,20.18 69,19.65 R10.2 68.57,19.48 v70.8,21.25
  Bottom 0.254: U3.7 67.04,26.86 70.8,23.1 v70.8,21.25
IO36
  Bottom 0.254: J8.3 77.02,21.08 76.97,21.07 67.45,30.6 64.95,30.6 U3.4
IO39
  Bottom 0.254: U3.5 64.95,29.4 67.35,29.4 73.72,23.02 73.72,22.31 77.45,18.54 J8.2
N$1
  Bottom 0.254: 19.5,19.8 U1.11 17.39,19.84 17.1,19.55 10.37,19.55 R2.2 8.05,19.58 8.05,34.5 15.25,34.5 16.94,36.19 SJ2.2
N$2
  Bottom 0.254: SJ1.2 11.34,40.7 19.02,40.7 19.02,36.73 21.65,34.1 21.65,26.15 U1.20
N$3
  Bottom 0.254: U1.26 17.4,30.35 14.28,27.23 14.28,27.18 13.42,26.32 R3.2
N$4
  Bottom 0.254: C3.2 20.5,5.95 20.5,10.9 21.65,12.05 21.65,13.54 U1.2
N$5
  Bottom 0.254: U1.3 22.25,14.24 22.25,8.27 C3.1
N$6
  Bottom 0.254: U1.4 17.4,14.95 17.4,10.7 18,10.1 18,5.85 C4.2
N$7
  Bottom 0.254: U1.5 16.65,15.65 16.65,7.8 C4.1
N$8  (via drill 0.35)
  Top 0.254: 44.4,30.4 44.4,28.8 | 44.4,28.8 44.4,28.65 IC2.8 | LED1.A 24.17,37.41 26.32,37.41 26.32,34.45 33.62,34.45 35.03,33.03 35.03,31.16 35.8,30.4 44.4,30.4 | 44.4,28.8 40.1,28.8 40.1,25.02 39.82,24.74 38.99,24.74 IC2.4 38.55,24.3 35.1,24.3 34.9,24.1 v34.9,24 35.85,23.05 Q3.1 | D3.A 39.15,19.4 40,20.25 40,20.5 | R19.1 40,20.5 | 40,20.5 39.7,20.8 v39.6,20.8 | C19.1 J7.PWR | 44.4,30.4 45.3,30.4 46.9,32 LED2.A 47.9,34.9 66.3,34.9
  Top 0.305: v67.2,33.3 67.2,34 66.3,34.9
  Bottom 0.254: v34.9,24 38.1,20.8 v39.6,20.8
  Bottom 0.406: v67.2,33.3 70.75,33.3 J7.PWR
N$9
  Top 0.406: C14.2 37.14,6.94 34.9,4.7 SPEAKER.1
N$10
  Top 0.254: R17.2 61.6,18.9 C16.2
N$11
  Bottom 0.254: U1.28 11.89,31.74 C5.2
N$12
  Bottom 0.254: C8.2 12.91,28.69 13.11,28.96 15.19,31.04 U1.27
N$13  (via drill 0.35)
  Top 0.254: D1.A 50.4,8.9 v50.1,9.2 | T3.1 46.95,10.5 v45.7,10.5 44.1,12.1 R4.1
  Bottom 0.254: v50.1,9.2 47,9.2 v45.7,10.5
N$14
  Top 0.254: R13.2 68.95,13.55 C6.1 71.4,11.1 72.9,11.1 72.9,14.15 T2.2
N$15
  Top 0.254: C9.2 72,13.2 70.95,14.25 T2.1 70.8,14.25 69.75,15.3 69.75,16.4 R10.1
N$16
  Top 0.254: R9.2 69.9,23.8 | R8.2 71.5,21.75 R9.2 | R9.2 69.45,26.15 C10.2
N$17
  Top 0.254: MK1.1 73.8,7.7 C9.1 73.85,12.65 73.85,14.4 74.9,15.45 74.9,23.65 R8.1
N$18
  Top 0.254: 57.35,6.45 T1.3 56.3,5.3 52.1,5.3 51.3,6.1 D2.C 50.95,6.15
  Top 0.406: 50.95,6.15 T4.B
N$19
  Top 0.254: R11.1 36.7,27.25 38.93,27.25 IC2.2
N$20
  Top 0.254: R15.1 56.15,11.1 | R15.1 56.35,11.1 | R15.1 R16.2 | R17.1 58.05,12.6 58,12.6 58,11.15 R16.2 | R16.2 58.35,10.8 T1.1
N$21
  Top 0.254: R12.1 25.6,30.25 25.6,36.83 21.63,36.83 LED1.K
N$22
  Top 0.254: 44.4,27.3 IC2.7 44.41,27.2 43.32,27.2 43.32,23.1 37.58,23.1 37.58,22.2 33.5,22.2 33,22.7 33,27.9 32.05,28.85 29.9,28.85 29.4,28.35 R12.2
N$24
  Top 0.254: D1.C 53.7,8.9
  Top 0.61: D1.C 54.3,6.6 D2.A
N$25
  Top 0.254: T1.2 56.45,7.48 59.08,7.48 59.08,6.07 R6.2
N$26
  Top 0.127: 48.2,9.1 43.6,9.1 43.22,9.48 C14.1 43.03,8.45 48.3,8.45
  Top 0.254: T3.2 48.9,10.35 | T4.E 48.3,8.45 | T3.2 48.95,9.85 48.2,9.1 | R15.2 49.65,11.1 T3.2
N$27
  Top 0.254: R18.1 47.9,28.7 LED2.C
N$28
  Top 0.254: R18.2 47.06,25.96 IC2.6
N$29  (via drill 0.41)
  Top 0.254: v10.3,13.6 13.7,13.6 13.7,21.9 13.5,22.1 13.5,23.35 13.85,23.7 v13.85,24.1
  Bottom 0.254: U1.15 17.66,22.64 16.2,24.1 v13.85,24.1 SJ3.2
  Bottom 0.406: R20.2 9.45,14.45 v10.3,13.6
N$30  (via drill 0.41)
  Top 0.254: v15.25,22.85 15.25,23.87 15.42,24.23 14.25,25.4 10,25.4 8.7,24.1 v8.7,10.1
  Bottom 0.254: U1.14 17.06,21.94 v15.25,22.85 | v8.7,10.1 9.75,9.05 R5.1
RXD0
  Bottom 0.254: RX_TX.2 37.7,43.25 37.7,38.05 40.9,34.85 40.9,33.4 44.9,29.4 U3.34
TXD0
  Bottom 0.254: RX_TX.1 40.1,37 42.2,34.9 42.2,33.4 44.9,30.7 46.87,30.7 U3.35
VCC  (via drill 0.41)
  Top 0.406: R7.2 66,20.25 66,20.7 67.55,22.25 R9.1 65.35,23.8 63.75,25.4 | 61.2,33.15 61.2,29.25 C11.1 | 61.2,33.15 61.2,33.6 59.1,33.6 R1.2 | 61.2,33.15 v63,33.15 | 63.75,27.9 63.75,25.4 | C11.1 62.5,29.05 63.65,27.9 63.75,27.9 | 63.75,25.4 51.7,25.4 C1.+ 51.6,21 51.6,20.25 47.95,16.6 44.55,16.6 v44.58,16.58 | R14.1 66.35,27.9 63.75,27.9 | v27.3,24.3 27.83,24.83 C17.1 30.4,24.23 U$3.VOUT | C11.1 C2.1
  Bottom 0.305: 17.1,18.45 15.3,18.45 | 13.75,7.55 15.05,7.55 15.05,3.7 | U1.6 17.11,16.34 17.1,16.35 17.1,18.45 | U1.9 17.11,18.44 17.1,18.45
  Bottom 0.406: v63,33.15 63.05,33.2 64.88,33.2 U3.2 | 15.3,18.45 13.5,18.45 | 13.5,18.45 12.67,18.45 12.02,17.8 8.6,17.8 | SJ2.1 14.59,39.3 14.59,37.59 12.5,35.5 7.05,35.5 7.05,17.95 7.2,17.8 8.6,17.8 | v27.3,24.3 27.3,12.62 33.6,12.62 | 33.6,12.62 44.48,12.62 44.58,12.59 v44.58,16.58 44.6,16.6 | 33.6,12.62 33.6,5.9 31.4,3.7 29.83,3.7 C15.1 29.77,3.7 15.05,3.7 9.75,3.7 R5.2 | R20.1 8.6,17.8 | 13.5,18.45 13.5,7.82 | 13.5,7.82 13.5,7.8 13.75,7.55 | C7.2 13.5,7.82
VIN
  Top 0.254: 34.9,20.87 34.93,20.9 35.15,20.9 | U$3.VIN 30.38,20.22 27.3,20.22 | T3.3 47.2,12.6 45.35,14.45 R4.2 42.4,14.45 41.25,13.3 39.2,13.3 38.5,14 38.5,16.5 37.7,17.3 36.8,17.3 36.8,19.15 D3.C 36.5,19.55 Q3.2 36.22,20.87
  Top 0.406: 30.38,20.22 32.65,20.22 C18.1 34.9,20.87 36.22,20.87
  Top 1.27: C12.1 27.3,20.22

### Text on the board
tPlace: 23 | 3v3 | EN | 36 | 39 | 34 | 32 | 33 | 26 | Gnd | 27 | 15 | 13 | 14 | 12
bPlace: For I2C | SJ1/2 | Close | GND | GND | +5V